# Altium schematic sheet Input.schdoc
size 420 x 297 mm; Author: G.K.; CompanyName: WUT; DrawnBy: G.K.; Address1: Warsaw Univeristy of Technology; Address2: Nowowiejska 15/19; DocumentNumber: 1; SheetNumber: 4; EDA_Number: ARTIQ; Projet: KASLI 3U subsystem; ModifiedBy: -; Title2: Input; DivGrp: ISE; Designer: G.K.; ModifiedDate: -; ProjectName: KASLI 3U subsystem
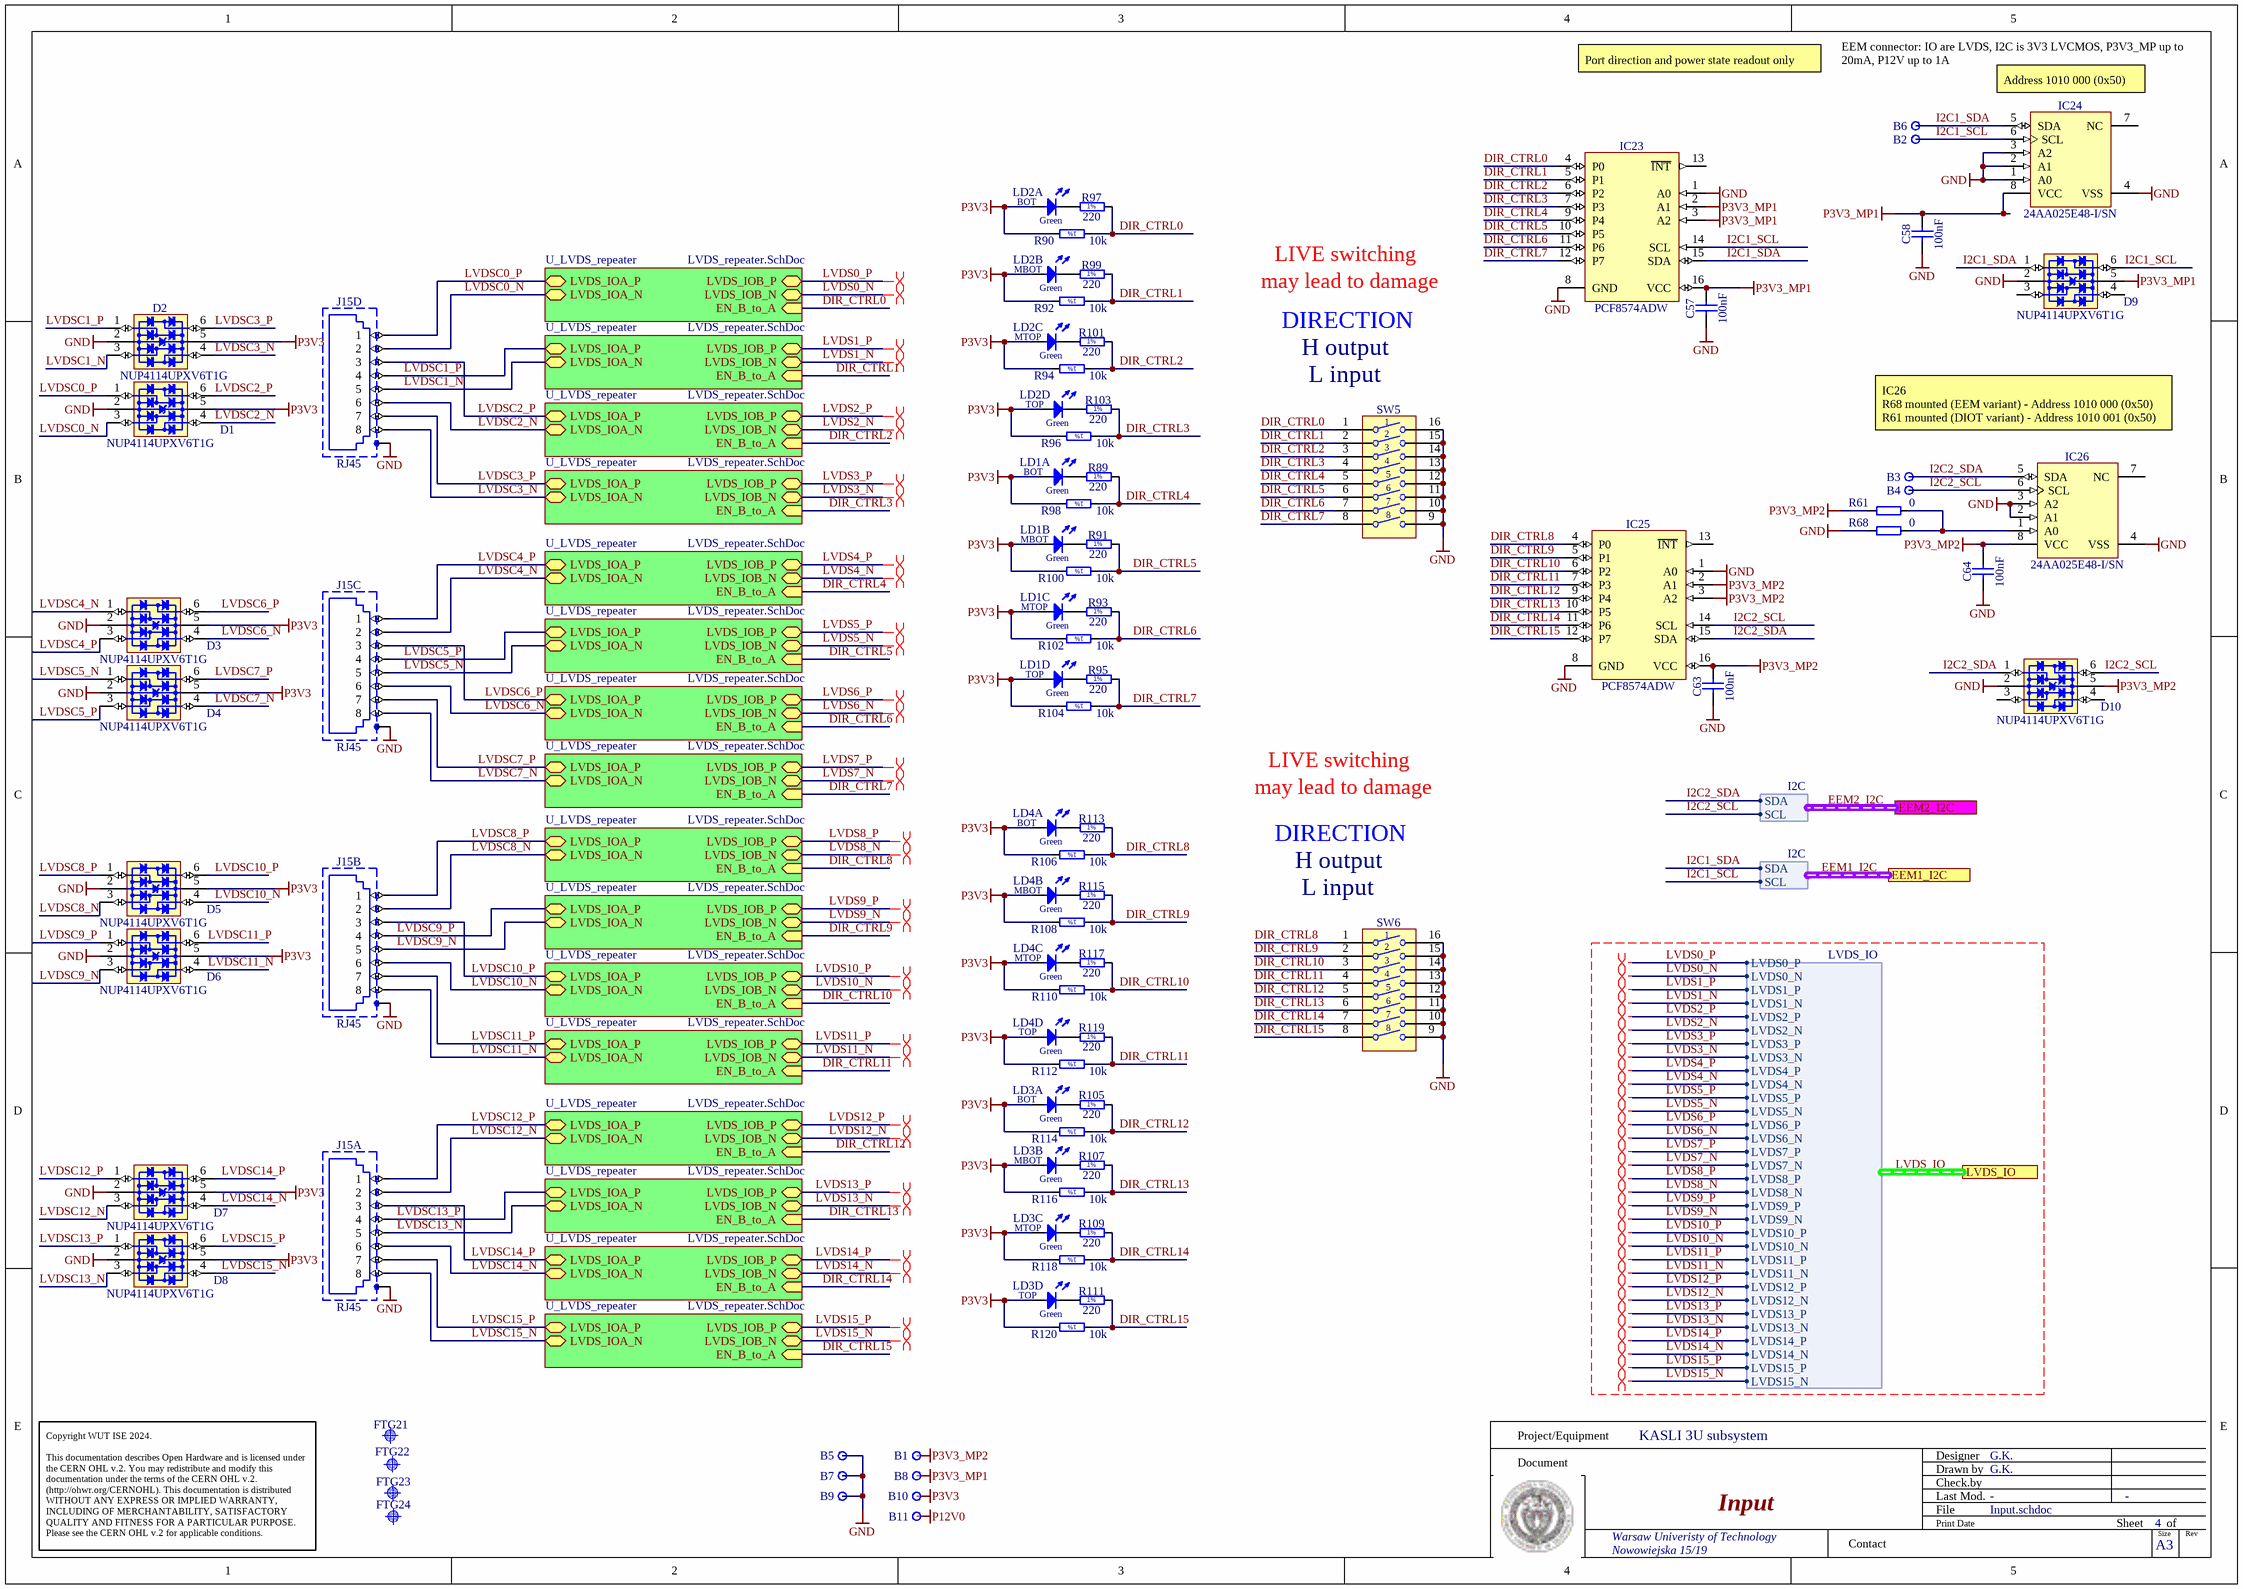
[diagram p0: Input.schdoc]

## Parts
B1  Plated Hole  [c130h60]  (value not drawn)
B2  Plated Hole  [c130h60]  (value not drawn)
B3  Plated Hole  [c130h60]  (value not drawn)
B4  Plated Hole  [c130h60]  (value not drawn)
B5  Plated Hole  [c130h60]  (value not drawn)
B6  Plated Hole  [c130h60]  (value not drawn)
B7  Plated Hole  [c130h60]  (value not drawn)
B8  Plated Hole  [c130h60]  (value not drawn)
B9  Plated Hole  [c130h60]  (value not drawn)
B10  Plated Hole  [c130h60]  (value not drawn)
B11  Plated Hole  [c130h60]  (value not drawn)
C57  100nF  [CAPC1005X55N]
C58  100nF  [CAPC1005X55N]
C63  100nF  [CAPC1005X55N]
C64  100nF  [CAPC1005X55N]
D1  NUP4114UPXV6T1G  [SOTFL50P160X60-6N]
D2  NUP4114UPXV6T1G  [SOTFL50P160X60-6N]
D3  NUP4114UPXV6T1G  [SOTFL50P160X60-6N]
D4  NUP4114UPXV6T1G  [SOTFL50P160X60-6N]
D5  NUP4114UPXV6T1G  [SOTFL50P160X60-6N]
D6  NUP4114UPXV6T1G  [SOTFL50P160X60-6N]
D7  NUP4114UPXV6T1G  [SOTFL50P160X60-6N]
D8  NUP4114UPXV6T1G  [SOTFL50P160X60-6N]
D9  NUP4114UPXV6T1G  [SOTFL50P160X60-6N]
D10  NUP4114UPXV6T1G  [SOTFL50P160X60-6N]
FTG21  Use only in PCB  [FIDUCIAL_TOP_C100-200]  (value not drawn)
FTG22  Use only in PCB  [FIDUCIAL_TOP_S100-200]  (value not drawn)
FTG23  Use only in PCB  [FIDUCIAL_TOP_S200-400]  (value not drawn)
FTG24  Use only in PCB  [FIDUCIAL_TOP_S100-200]  (value not drawn)
IC23  PCF8574ADW  [SOIC127P1030X265-16N]
IC24  24AA025E48-I/SN  [SOIC127P600X175-8N]
IC25  PCF8574ADW  [SOIC127P1030X265-16N]
IC26  24AA025E48-I/SN  [SOIC127P600X175-8N]
J15  RJ45  [TYCO_5406203-3]  (parts A,B,C,D of 4)
LD1  Green  [LED_BIVAR_H485CGDL]  (value not drawn)  (parts A,B,C,D of 4)
LD2  Green  [LED_BIVAR_H485CGDL]  (value not drawn)  (parts A,B,C,D of 4)
LD3  Green  [LED_BIVAR_H485CGDL]  (value not drawn)  (parts A,B,C,D of 4)
LD4  Green  [LED_BIVAR_H485CGDL]  (value not drawn)  (parts A,B,C,D of 4)
R61  0  [RESC1005X35N]
R68  0  [RESC1005X35N]
R89  220  [RESC1608X55N]
R90  10k  [RESC1005X40N]
R91  220  [RESC1608X55N]
R92  10k  [RESC1005X40N]
R93  220  [RESC1608X55N]
R94  10k  [RESC1005X40N]
R95  220  [RESC1608X55N]
R96  10k  [RESC1005X40N]
R97  220  [RESC1608X55N]
R98  10k  [RESC1005X40N]
R99  220  [RESC1608X55N]
R100  10k  [RESC1005X40N]
R101  220  [RESC1608X55N]
R102  10k  [RESC1005X40N]
R103  220  [RESC1608X55N]
R104  10k  [RESC1005X40N]
R105  220  [RESC1608X55N]
R106  10k  [RESC1005X40N]
R107  220  [RESC1608X55N]
R108  10k  [RESC1005X40N]
R109  220  [RESC1608X55N]
R110  10k  [RESC1005X40N]
R111  220  [RESC1608X55N]
R112  10k  [RESC1005X40N]
R113  220  [RESC1608X55N]
R114  10k  [RESC1005X40N]
R115  220  [RESC1608X55N]
R116  10k  [RESC1005X40N]
R117  220  [RESC1608X55N]
R118  10k  [RESC1005X40N]
R119  220  [RESC1608X55N]
R120  10k  [RESC1005X40N]
SW5  Switch  [SW_TYCO_1-1571983-0]  (value not drawn)
SW6  Switch  [SW_TYCO_1-1571983-0]  (value not drawn)

## Sub-sheets
U_LVDS_repeater = LVDS_repeater.SchDoc: LVDS_IOA_P (bidir), LVDS_IOA_N (bidir), LVDS_IOB_P (bidir), LVDS_IOB_N (bidir), EN_B_to_A (in)
U_LVDS_repeater = LVDS_repeater.SchDoc: LVDS_IOA_P (bidir), LVDS_IOA_N (bidir), LVDS_IOB_P (bidir), LVDS_IOB_N (bidir), EN_B_to_A (in)
U_LVDS_repeater = LVDS_repeater.SchDoc: LVDS_IOA_P (bidir), LVDS_IOA_N (bidir), LVDS_IOB_P (bidir), LVDS_IOB_N (bidir), EN_B_to_A (in)
U_LVDS_repeater = LVDS_repeater.SchDoc: LVDS_IOA_P (bidir), LVDS_IOA_N (bidir), LVDS_IOB_P (bidir), LVDS_IOB_N (bidir), EN_B_to_A (in)
U_LVDS_repeater = LVDS_repeater.SchDoc: LVDS_IOA_P (bidir), LVDS_IOA_N (bidir), LVDS_IOB_P (bidir), LVDS_IOB_N (bidir), EN_B_to_A (in)
U_LVDS_repeater = LVDS_repeater.SchDoc: LVDS_IOA_P (bidir), LVDS_IOA_N (bidir), LVDS_IOB_P (bidir), LVDS_IOB_N (bidir), EN_B_to_A (in)
U_LVDS_repeater = LVDS_repeater.SchDoc: LVDS_IOA_P (bidir), LVDS_IOA_N (bidir), LVDS_IOB_P (bidir), LVDS_IOB_N (bidir), EN_B_to_A (in)
U_LVDS_repeater = LVDS_repeater.SchDoc: LVDS_IOA_P (bidir), LVDS_IOA_N (bidir), LVDS_IOB_P (bidir), LVDS_IOB_N (bidir), EN_B_to_A (in)
U_LVDS_repeater = LVDS_repeater.SchDoc: LVDS_IOA_P (bidir), LVDS_IOA_N (bidir), LVDS_IOB_P (bidir), LVDS_IOB_N (bidir), EN_B_to_A (in)
U_LVDS_repeater = LVDS_repeater.SchDoc: LVDS_IOA_P (bidir), LVDS_IOA_N (bidir), LVDS_IOB_P (bidir), LVDS_IOB_N (bidir), EN_B_to_A (in)
U_LVDS_repeater = LVDS_repeater.SchDoc: LVDS_IOA_P (bidir), LVDS_IOA_N (bidir), LVDS_IOB_P (bidir), LVDS_IOB_N (bidir), EN_B_to_A (in)
U_LVDS_repeater = LVDS_repeater.SchDoc: LVDS_IOA_P (bidir), LVDS_IOA_N (bidir), LVDS_IOB_P (bidir), LVDS_IOB_N (bidir), EN_B_to_A (in)
U_LVDS_repeater = LVDS_repeater.SchDoc: LVDS_IOA_P (bidir), LVDS_IOA_N (bidir), LVDS_IOB_P (bidir), LVDS_IOB_N (bidir), EN_B_to_A (in)
U_LVDS_repeater = LVDS_repeater.SchDoc: LVDS_IOA_P (bidir), LVDS_IOA_N (bidir), LVDS_IOB_P (bidir), LVDS_IOB_N (bidir), EN_B_to_A (in)
U_LVDS_repeater = LVDS_repeater.SchDoc: LVDS_IOA_P (bidir), LVDS_IOA_N (bidir), LVDS_IOB_P (bidir), LVDS_IOB_N (bidir), EN_B_to_A (in)
U_LVDS_repeater = LVDS_repeater.SchDoc: LVDS_IOA_P (bidir), LVDS_IOA_N (bidir), LVDS_IOB_P (bidir), LVDS_IOB_N (bidir), EN_B_to_A (in)

## Ports
EEM1_I2C (harness I2C), EEM2_I2C (harness I2C), LVDS_IO (harness LVDS_IO)

## Harnesses
I2C: SDA, SCL
LVDS_IO: LVDS0_P, LVDS0_N, LVDS1_P, LVDS1_N, LVDS2_P, LVDS2_N, LVDS3_P, LVDS3_N, LVDS4_P, LVDS4_N, LVDS5_P, LVDS5_N, LVDS6_P, LVDS6_N, LVDS7_P, LVDS7_N, LVDS8_P, LVDS8_N, LVDS9_P, LVDS9_N, LVDS10_P, LVDS10_N, LVDS11_P, LVDS11_N, LVDS12_P, LVDS12_N, LVDS13_P, LVDS13_N, LVDS14_P, LVDS14_N, LVDS15_P, LVDS15_N

## Nets
GND: B5.1 B7.1 B9.1 C57.1 C58.1 C63.1 C64.1 D1.2(GND) D2.2(GND) D3.2(GND) D4.2(GND) D5.2(GND) D6.2(GND) D7.2(GND) D8.2(GND) D9.2(GND) D10.2(GND) IC23.1(A0) IC23.8(GND) IC24.1(A0) IC24.2(A1) IC24.3(A2) IC24.4(VSS) IC25.1(A0) IC25.8(GND) IC26.2(A1) IC26.3(A2) IC26.4(VSS) J15.SH R68.2 SW5.9 SW5.10 SW5.11 SW5.12 SW5.13 SW5.14 SW5.15 SW5.16 SW6.9 SW6.10 SW6.11 SW6.12 SW6.13 SW6.14 SW6.15 SW6.16
P3V3: B10.1 D1.5(VBUS) D2.5(VBUS) D3.5(VBUS) D4.5(VBUS) D5.5(VBUS) D6.5(VBUS) D7.5(VBUS) D8.5(VBUS) LD1.2(A) LD1.4(A) LD1.6(A) LD1.8(A) LD2.2(A) LD2.4(A) LD2.6(A) LD2.8(A) LD3.2(A) LD3.4(A) LD3.6(A) LD3.8(A) LD4.2(A) LD4.4(A) LD4.6(A) LD4.8(A) R90.2 R92.2 R94.2 R96.2 R98.2 R100.2 R102.2 R104.2 R106.2 R108.2 R110.2 R112.2 R114.2 R116.2 R118.2 R120.2
P3V3_MP1: B8.1 C57.2 C58.2 D9.5(VBUS) IC23.2(A1) IC23.3(A2) IC23.16(VCC) IC24.8(VCC)
P3V3_MP2: B1.1 C63.2 C64.2 D10.5(VBUS) IC25.2(A1) IC25.3(A2) IC25.16(VCC) IC26.8(VCC) R61.2
P12V0: B11.1
DIR_CTRL0: IC23.4(P0) R90.1 R97.2 SW5.1 ; sheet U_LVDS_repeater/EN_B_to_A
DIR_CTRL1: IC23.5(P1) R92.1 R99.2 SW5.2 ; sheet U_LVDS_repeater/EN_B_to_A
DIR_CTRL2: IC23.6(P2) R94.1 R101.2 SW5.3 ; sheet U_LVDS_repeater/EN_B_to_A
DIR_CTRL3: IC23.7(P3) R96.1 R103.2 SW5.4 ; sheet U_LVDS_repeater/EN_B_to_A
DIR_CTRL4: IC23.9(P4) R89.2 R98.1 SW5.5 ; sheet U_LVDS_repeater/EN_B_to_A
DIR_CTRL5: IC23.10(P5) R91.2 R100.1 SW5.6 ; sheet U_LVDS_repeater/EN_B_to_A
DIR_CTRL6: IC23.11(P6) R93.2 R102.1 SW5.7 ; sheet U_LVDS_repeater/EN_B_to_A
DIR_CTRL7: IC23.12(P7) R95.2 R104.1 SW5.8 ; sheet U_LVDS_repeater/EN_B_to_A
DIR_CTRL8: IC25.4(P0) R106.1 R113.2 SW6.1 ; sheet U_LVDS_repeater/EN_B_to_A
DIR_CTRL9: IC25.5(P1) R108.1 R115.2 SW6.2 ; sheet U_LVDS_repeater/EN_B_to_A
DIR_CTRL10: IC25.6(P2) R110.1 R117.2 SW6.3 ; sheet U_LVDS_repeater/EN_B_to_A
DIR_CTRL11: IC25.7(P3) R112.1 R119.2 SW6.4 ; sheet U_LVDS_repeater/EN_B_to_A
DIR_CTRL12: IC25.9(P4) R105.2 R114.1 SW6.5 ; sheet U_LVDS_repeater/EN_B_to_A
DIR_CTRL13: IC25.10(P5) R107.2 R116.1 SW6.6 ; sheet U_LVDS_repeater/EN_B_to_A
DIR_CTRL14: IC25.11(P6) R109.2 R118.1 SW6.7 ; sheet U_LVDS_repeater/EN_B_to_A
DIR_CTRL15: IC25.12(P7) R111.2 R120.1 SW6.8 ; sheet U_LVDS_repeater/EN_B_to_A
I2C1_SCL: B2.1 D9.6(I/O4) IC23.14(SCL) IC24.6(SCL) ; port EEM1_I2C.SCL  [project net EEM1_I2C.SCL]
I2C1_SDA: B6.1 D9.1(I/O1) IC23.15(SDA) IC24.5(SDA) ; port EEM1_I2C.SDA  [project net EEM1_I2C.SDA]
I2C2_SCL: B4.1 D10.6(I/O4) IC25.14(SCL) IC26.6(SCL) ; port EEM2_I2C.SCL  [project net EEM2_I2C.SCL]
I2C2_SDA: B3.1 D10.1(I/O1) IC25.15(SDA) IC26.5(SDA) ; port EEM2_I2C.SDA  [project net EEM2_I2C.SDA]
LVDS0_N: sheet U_LVDS_repeater/LVDS_IOB_N, port LVDS_IO.LVDS0_N
LVDS0_P: sheet U_LVDS_repeater/LVDS_IOB_P, port LVDS_IO.LVDS0_P
LVDS1_N: sheet U_LVDS_repeater/LVDS_IOB_N, port LVDS_IO.LVDS1_N
LVDS1_P: sheet U_LVDS_repeater/LVDS_IOB_P, port LVDS_IO.LVDS1_P
LVDS2_N: sheet U_LVDS_repeater/LVDS_IOB_N, port LVDS_IO.LVDS2_N
LVDS2_P: sheet U_LVDS_repeater/LVDS_IOB_P, port LVDS_IO.LVDS2_P
LVDS3_N: sheet U_LVDS_repeater/LVDS_IOB_N, port LVDS_IO.LVDS3_N
LVDS3_P: sheet U_LVDS_repeater/LVDS_IOB_P, port LVDS_IO.LVDS3_P
LVDS4_N: sheet U_LVDS_repeater/LVDS_IOB_N, port LVDS_IO.LVDS4_N
LVDS4_P: sheet U_LVDS_repeater/LVDS_IOB_P, port LVDS_IO.LVDS4_P
LVDS5_N: sheet U_LVDS_repeater/LVDS_IOB_N, port LVDS_IO.LVDS5_N
LVDS5_P: sheet U_LVDS_repeater/LVDS_IOB_P, port LVDS_IO.LVDS5_P
LVDS6_N: sheet U_LVDS_repeater/LVDS_IOB_N, port LVDS_IO.LVDS6_N
LVDS6_P: sheet U_LVDS_repeater/LVDS_IOB_P, port LVDS_IO.LVDS6_P
LVDS7_N: sheet U_LVDS_repeater/LVDS_IOB_N, port LVDS_IO.LVDS7_N
LVDS7_P: sheet U_LVDS_repeater/LVDS_IOB_P, port LVDS_IO.LVDS7_P
LVDS8_N: sheet U_LVDS_repeater/LVDS_IOB_N, port LVDS_IO.LVDS8_N
LVDS8_P: sheet U_LVDS_repeater/LVDS_IOB_P, port LVDS_IO.LVDS8_P
LVDS9_N: sheet U_LVDS_repeater/LVDS_IOB_N, port LVDS_IO.LVDS9_N
LVDS9_P: sheet U_LVDS_repeater/LVDS_IOB_P, port LVDS_IO.LVDS9_P
LVDS10_N: sheet U_LVDS_repeater/LVDS_IOB_N, port LVDS_IO.LVDS10_N
LVDS10_P: sheet U_LVDS_repeater/LVDS_IOB_P, port LVDS_IO.LVDS10_P
LVDS11_N: sheet U_LVDS_repeater/LVDS_IOB_N, port LVDS_IO.LVDS11_N
LVDS11_P: sheet U_LVDS_repeater/LVDS_IOB_P, port LVDS_IO.LVDS11_P
LVDS12_N: sheet U_LVDS_repeater/LVDS_IOB_N, port LVDS_IO.LVDS12_N
LVDS12_P: sheet U_LVDS_repeater/LVDS_IOB_P, port LVDS_IO.LVDS12_P
LVDS13_N: sheet U_LVDS_repeater/LVDS_IOB_N, port LVDS_IO.LVDS13_N
LVDS13_P: sheet U_LVDS_repeater/LVDS_IOB_P, port LVDS_IO.LVDS13_P
LVDS14_N: sheet U_LVDS_repeater/LVDS_IOB_N, port LVDS_IO.LVDS14_N
LVDS14_P: sheet U_LVDS_repeater/LVDS_IOB_P, port LVDS_IO.LVDS14_P
LVDS15_N: sheet U_LVDS_repeater/LVDS_IOB_N, port LVDS_IO.LVDS15_N
LVDS15_P: sheet U_LVDS_repeater/LVDS_IOB_P, port LVDS_IO.LVDS15_P
LVDSC0_N: D1.3(I/O2) J15.2D(2) ; sheet U_LVDS_repeater/LVDS_IOA_N
LVDSC0_P: D1.1(I/O1) J15.1D(1) ; sheet U_LVDS_repeater/LVDS_IOA_P
LVDSC1_N: D2.3(I/O2) J15.5D(5) ; sheet U_LVDS_repeater/LVDS_IOA_N
LVDSC1_P: D2.1(I/O1) J15.4D(4) ; sheet U_LVDS_repeater/LVDS_IOA_P
LVDSC2_N: D1.4(I/O3) J15.6D(6) ; sheet U_LVDS_repeater/LVDS_IOA_N
LVDSC2_P: D1.6(I/O4) J15.3D(3) ; sheet U_LVDS_repeater/LVDS_IOA_P
LVDSC3_N: D2.4(I/O3) J15.8D(8) ; sheet U_LVDS_repeater/LVDS_IOA_N
LVDSC3_P: D2.6(I/O4) J15.7D(7) ; sheet U_LVDS_repeater/LVDS_IOA_P
LVDSC4_N: D3.1(I/O1) J15.2C(2) ; sheet U_LVDS_repeater/LVDS_IOA_N
LVDSC4_P: D3.3(I/O2) J15.1C(1) ; sheet U_LVDS_repeater/LVDS_IOA_P
LVDSC5_N: D4.1(I/O1) J15.5C(5) ; sheet U_LVDS_repeater/LVDS_IOA_N
LVDSC5_P: D4.3(I/O2) J15.4C(4) ; sheet U_LVDS_repeater/LVDS_IOA_P
LVDSC6_N: D3.4(I/O3) J15.6C(6) ; sheet U_LVDS_repeater/LVDS_IOA_N
LVDSC6_P: D3.6(I/O4) J15.3C(3) ; sheet U_LVDS_repeater/LVDS_IOA_P
LVDSC7_N: D4.4(I/O3) J15.8C(8) ; sheet U_LVDS_repeater/LVDS_IOA_N
LVDSC7_P: D4.6(I/O4) J15.7C(7) ; sheet U_LVDS_repeater/LVDS_IOA_P
LVDSC8_N: D5.3(I/O2) J15.2B(2) ; sheet U_LVDS_repeater/LVDS_IOA_N
LVDSC8_P: D5.1(I/O1) J15.1B(1) ; sheet U_LVDS_repeater/LVDS_IOA_P
LVDSC9_N: D6.3(I/O2) J15.5B(5) ; sheet U_LVDS_repeater/LVDS_IOA_N
LVDSC9_P: D6.1(I/O1) J15.4B(4) ; sheet U_LVDS_repeater/LVDS_IOA_P
LVDSC10_N: D5.4(I/O3) J15.6B(6) ; sheet U_LVDS_repeater/LVDS_IOA_N
LVDSC10_P: D5.6(I/O4) J15.3B(3) ; sheet U_LVDS_repeater/LVDS_IOA_P
LVDSC11_N: D6.4(I/O3) J15.8B(8) ; sheet U_LVDS_repeater/LVDS_IOA_N
LVDSC11_P: D6.6(I/O4) J15.7B(7) ; sheet U_LVDS_repeater/LVDS_IOA_P
LVDSC12_N: D7.3(I/O2) J15.2A(2) ; sheet U_LVDS_repeater/LVDS_IOA_N
LVDSC12_P: D7.1(I/O1) J15.1A(1) ; sheet U_LVDS_repeater/LVDS_IOA_P
LVDSC13_N: D8.3(I/O2) J15.5A(5) ; sheet U_LVDS_repeater/LVDS_IOA_N
LVDSC13_P: D8.1(I/O1) J15.4A(4) ; sheet U_LVDS_repeater/LVDS_IOA_P
LVDSC14_N: D7.4(I/O3) J15.6A(6) ; sheet U_LVDS_repeater/LVDS_IOA_N
LVDSC14_P: D7.6(I/O4) J15.3A(3) ; sheet U_LVDS_repeater/LVDS_IOA_P
LVDSC15_N: D8.4(I/O3) J15.8A(8) ; sheet U_LVDS_repeater/LVDS_IOA_N
LVDSC15_P: D8.6(I/O4) J15.7A(7) ; sheet U_LVDS_repeater/LVDS_IOA_P
NetIC26_1: IC26.1(A0) R61.1 R68.1
NetLD1_1: LD1.1(C) R89.1
NetLD1_3: LD1.3(C) R91.1
NetLD1_5: LD1.5(C) R93.1
NetLD1_7: LD1.7(C) R95.1
NetLD2_1: LD2.1(C) R97.1
NetLD2_3: LD2.3(C) R99.1
NetLD2_5: LD2.5(C) R101.1
NetLD2_7: LD2.7(C) R103.1
NetLD3_1: LD3.1(C) R105.1
NetLD3_3: LD3.3(C) R107.1
NetLD3_5: LD3.5(C) R109.1
NetLD3_7: LD3.7(C) R111.1
NetLD4_1: LD4.1(C) R113.1
NetLD4_3: LD4.3(C) R115.1
NetLD4_5: LD4.5(C) R117.1
NetLD4_7: LD4.7(C) R119.1

Not connected (* = marked no-connect by the designer): D9 3(I/O2) 4(I/O3); D10 3(I/O2) 4(I/O3); IC23 13(~{INT}); IC24 7(NC); IC25 13(~{INT}); IC26 7(NC)

## Buses and harness runs
harness EEM1_I2C = port EEM1_I2C
harness EEM2_I2C = port EEM2_I2C
harness LVDS_IO = port LVDS_IO

## Layout directives
differential pair: LVDS0_N, LVDS0_P, LVDS1_N, LVDS1_P, LVDS2_N, LVDS2_P, LVDS3_N, LVDS3_P, LVDS4_N, LVDS4_P, LVDS5_N, LVDS5_P, LVDS6_N, LVDS6_P, LVDS7_N, LVDS7_P, LVDS8_N, LVDS8_P, LVDS9_N, LVDS9_P, LVDS10_N, LVDS10_P, LVDS11_N, LVDS11_P, LVDS12_N, LVDS12_P, LVDS13_N, LVDS13_P, LVDS14_N, LVDS14_P, LVDS15_N, LVDS15_P

## Notes on the sheet
- Port direction and power state readout only
- EEM connector: IO are LVDS, I2C is 3V3 LVCMOS, P3V3_MP up to 20mA, P12V up to 1A
- (near IC24) Address 1010 000 (0x50)
- LIVE switching
- may lead to damage
- DIRECTION
- H output
- (near SW5) L input
- IC26
  R68 mounted (EEM variant) - Address 1010 000 (0x50)
  R61 mounted (DIOT variant) - Address 1010 001 (0x50)
- (near SW6) L input
- Project/Equipment
- Document
- Designer
- Drawn by
- Check.by
- Copyright WUT ISE 2024.
  This documentation describes Open Hardware and is licensed under the CERN OHL v.2. You may redistribute and modify this documentation under the terms of the CERN OHL v.2. (http://ohwr.org/CERNOHL). This documentation is distributed WITHOUT ANY EXPRESS OR IMPLIED WARRANTY, INCLUDING OF MERCHANTABILITY, SATISFACTORY QUALITY AND FITNESS FOR A PARTICULAR PURPOSE. Please see the CERN OHL v.2 for applicable conditions.
- Contact
- File
- Last Mod.
- Print Date
- Sheet
- Size
- A3
- of
- Rev
- (in symbol LED_BIVAR_H485CGDL, part A) BOT
- (in symbol LED_BIVAR_H485CGDL, part B) MBOT
- (in symbol LED_BIVAR_H485CGDL, part C) MTOP
- (in symbol LED_BIVAR_H485CGDL, part D) TOP
- (in symbol R0402_10K_1%_0.0625W_100PPM) 1%
- (in symbol R0603_220R_1%_0.1W_100PPM) 1%

## Library data of the parts
B1-B11 = PLATED_HOLE0.6_PAD1.3: Single Terminal Socket; Part Description: Plated Through Hole: Hole Dia.=0.6mm Pad Dia.=1.3mm; Mounted: No; Part Number: PLATED_HOLE0.6_PAD1.3; Component Kind: Standard (No BOM); Component Type: Standard (No BOM); Pin Count: 1; Family: Plated Hole; Socket: No; SMD: No; Sense: No; Status: None; ComponentHeight: 0mm; HelpURL: Undefined; Author: CERN DEM MR; CreateDate: 02.03.2016; LatestRevisionDate: 02.03.2016; PackageDescription: Plated Through Hole: Hole Dia.=0.6mm Pad Dia.=1.3mm
C57 C58 C63 C64 = CC0402_100NF_16V_10%_X5R: Non-polarised capacitor; Part Description: SMD Multilayer Chip Ceramic Capacitor; Manufacturer: GENERIC; Manufacturer1 Part Number: GRM155R61C104KA88D; Voltage: 16V; TC: X5R; Tolerance: ±10%; Part Number: CC0402_100NF_16V_10%_X5R; Component Kind: Standard; Component Type: Standard; Pin Count: 2; Value: 100nF; Status: None; Manufacturer Part Number: CC0402_100NF_16V_10%_X5R; Case: 0402; Mounted: Yes; Socket: No; SMD: Yes; Sense: No; Manufacturer1 Example: MURATA; Manufacturer1 ComponentHeight: 0.55mm; HelpURL: \\cern.ch\dfs\Applications\Altium\Datasheets\CC0402_X5R_MURATA_GRM.pdf; Author: CERN DEM JLC; CreateDate: 10.12.2013; LatestRevisionDate: 10.12.2013
D1-D10 = NUP4114UPXV6T1G: Part Description: ESD Protection Diodes Array (8kV) with Low Clamping Voltage; Manufacturer: ON SEMICONDUCTOR; Voltage: 5.5V; PressFit: No; Bonding: No; Part Number: NUP4114UPXV6T1G; Component Kind: Standard; Component Type: Standard; Device: NUP4114UPXV6T1G; PackageDescription: SOTFL (SOT666, SOT563,), 0.50mm, Pitch; 6 Pin, 1.20mm W X 1.60mm L X 0.60mm H Body, IPC Medium Density; Manufacturer Part Number: NUP4114UPXV6T1G; Pin Count: 8; Mounted: Yes; Socket: No; SMD: Yes; Sense: No; ComponentHeight: 1.75mm; HelpURL: \\cern.ch\dfs\Applications\Altium\Datasheets\NUP4114UPXV6T1G.pdf; Author: CERN DEM JLC; CreateDate: 05.12.2012; LatestRevisionDate: 05.12.2012
FTG21 = FIDUCIAL_TARGET_C100-200: Fiducial Target; Part Description: Round Fiducial Target, Top Layer, 1.0mm, Top Solder 2.0mm, Keepout =2.0mm; Mounted: No; Part Number: FIDUCIAL_TARGET_C100-200; Component Kind: Standard (No BOM); Component Type: Standard (No BOM); Pin Count: 1; Family: Fiducial; Socket: No; SMD: Yes; Sense: No; Status: None; ComponentHeight: 0mm; HelpURL: Undefined; Author: CERN DEM JLC; CreateDate: 09.02.2010; LatestRevisionDate: 04.04.2012; PackageDescription: Round Fiducial Target, Top Layer, 1.0mm, Top Solder 2.0mm, Keepout =2.0mm
FTG22 FTG24 = FIDUCIAL_TARGET_S100-200: Fiducial Target; Part Description: Square Fiducial Target, Top Layer, 1.0mm, Top Solder 2.0mm, Keepout =2.0mm; Mounted: No; Part Number: FIDUCIAL_TARGET_S100-200; Component Kind: Standard (No BOM); Component Type: Standard (No BOM); Pin Count: 1; Family: Fiducial; Socket: No; SMD: Yes; Sense: No; Status: None; ComponentHeight: 0mm; HelpURL: Undefined; Author: CERN DEM JLC; CreateDate: 09.02.2010; LatestRevisionDate: 04.04.2012; PackageDescription: Square Fiducial Target, Top Layer, 1.0mm, Top Solder 2.0mm, Keepout =2.0mm
FTG23 = FIDUCIAL_TARGET_S200-400: Fiducial Target; Part Description: Square Fiducial Target, Top Layer, 2.0mm, Top Solder 4.0mm, Keepout =4.0mm; Mounted: No; Part Number: FIDUCIAL_TARGET_S200-400; Component Kind: Standard (No BOM); Component Type: Standard (No BOM); Pin Count: 1; Family: Fiducial; Socket: No; SMD: Yes; Sense: No; Status: None; ComponentHeight: 0mm; HelpURL: Undefined; Author: CERN DEM JLC; CreateDate: 02.06.2008; LatestRevisionDate: 04.04.2012; PackageDescription: Square Fiducial Target, Top Layer, 2.0mm, Top Solder 4.0mm, Keepout =4.0mm
IC23 IC25 = PCF8574ADW: Remote 8-bit I/O Expander For I2C Bus; Manufacturer: TEXAS INSTRUMENTS; PressFit: No; Bonding: No; Part Number: PCF8574ADW; Component Kind: Standard; Component Type: Standard; Device: PCF8574ADW; PackageDescription: SOIC 16, Pitch 1.27mm - Body 7.5x10.3mm, IPC Medium Density; Part Description: Remote 8-bit I/O Expander For I2C Bus; Manufacturer Part Number: PCF8574ADW; Pin Count: 16; Case: SOIC16W; Mounted: Yes; Socket: No; SMD: Yes; Sense: No; ComponentHeight: 2.65mm; Author: CERN DEM JLC; HelpURL: \\cern.ch\dfs\Applications\Altium\Datasheets\PCF8574ADW.pdf; CreateDate: 01.11.2012; LatestRevisionDate: 01.11.2012
IC24 IC26 = 24AA025E48-I/SN: 1.7V-5.5V, 2K I2C™ Serial EEPROMs with EUI-48™ Node Identity; Manufacturer: MICROCHIP TECHNOLOGY; PressFit: No; Bonding: No; Part Number: 24AA025E48-I/SN; Component Kind: Standard; Component Type: Standard; Device: 24AA025E48-I/SN; PackageDescription: SOIC, 1.27mm Pitch; 8 Pin - Body 4x5mm, IPC Medium Density; Part Description: 1.7V-5.5V, 2K I2C™ Serial EEPROMs with EUI-48™ Node Identity; Manufacturer Part Number: 24AA025E48-I/SN; Pin Count: 8; Case: SOIC8; Mounted: Yes; Socket: No; SMD: Yes; Sense: No; ComponentHeight: 1.75mm; HelpURL: \\cern.ch\dfs\Applications\Altium\Datasheets\24AA025E48-I-SN.pdf; Author: CERN DEM MR; CreateDate: 19.07.2016; LatestRevisionDate: 19.07.2016
J15 = TYCO_5406203-3: Connector 4 x RJ45 + Shield; Part Description: Modular RJ45 Jack, 4 Port, 8 Positions, Shielded, Reverse Panel Ground Tabs, Category 5; Manufacturer: TYCO ELECTRONICS; PressFit: No; Part Number: TYCO_5406203-3; Component Kind: Standard; Component Type: Standard; Pin Count: 33; Family: RJ45; Mounted: Yes; Socket: No; SMD: No; Sense: No; Status: None; Manufacturer Part Number: 5406203-3; ComponentHeight: 13.64mm; HelpURL: \\cern.ch\dfs\Applications\Altium\Datasheets\TYCO_5406203-3.pdf; Author: CERN DEM JLC; CreateDate: 30.10.2008; LatestRevisionDate: 30.10.2008
LD1-LD4 = LED_BIVAR_H485CGDL: LED x4 Green 1C2A-BOT_3C4A_5C6A_7C8A-TOP; Part Description: Quad-Level 2mm Green LED, PCB Edge Mounting; Manufacturer: BIVAR; PressFit: No; Bonding: No; Part Number: LED_BIVAR_H485CGDL; Component Kind: Standard; Component Type: Standard; Color: Green; PackageDescription: Quad-Level 2mm Green, PCB Edge Mounting  BIVAR H485CHDL; Manufacturer Part Number: H485CGDL; Pin Count: 8; Mounted: Yes; Socket: No; SMD: No; Sense: No; ComponentHeight: 11.3mm; HelpURL: \\cern.ch\dfs\Applications\Altium\Datasheets\LED_BIVAR_H485CGDL.pdf; Author: CERN DEM JLC; CreateDate: 04.06.2012; LatestRevisionDate: 04.06.2012
R61 R68 = R0402_0R_JUMPER: Resistor; Part Description: 1A (0.05R Max DC Resistance) Zero Ohm Jumper; Manufacturer: GENERIC; Manufacturer1 Part Number: 232270591001L; Part Number: R0402_0R_JUMPER; Component Kind: Standard; Component Type: Standard; Footprint: RESC1005X40N; Pin Count: 2; Value: 0; Status: Not recommended; Manufacturer Part Number: R0402_0R_JUMPER; Case: 0402; Mounted: Yes; Sense: No; Socket: No; SMD: Yes; Manufacturer1 Example: YAGEO PHYCOMP; Manufacturer1 ComponentHeight: 0.4mm; HelpURL: \\cern.ch\dfs\Applications\Altium\Datasheets\R0402_Phycomp_RC0402.pdf; Author: CERN DEM JLC; CreateDate: 03.12.2007; LatestRevisionDate: 17.10.2012
R89 R91 R93 R95 R97 R99 R101 R103 R105 R107 R109 R111 R113 R115 R117 R119 = R0603_220R_1%_0.1W_100PPM: Resistor - 1%; Part Description: General Purpose Thick Film Chip Resistor; Manufacturer: GENERIC; Manufacturer1 Part Number: NRC06F2200TRF; Power: 0.1W; TC: ±100ppm/°C; Part Number: R0603_220R_1%_0.1W_100PPM; Component Kind: Standard; Component Type: Standard; Pin Count: 2; Value: 220; Status: Preferred; Tolerance: ±1%; Manufacturer Part Number: R0603_220R_1%_0.1W_100PPM; Case: 0603; Mounted: Yes; Sense: No; Socket: No; SMD: Yes; Manufacturer1 Example: NIC COMPONENT; Manufacturer1 ComponentHeight: 0.55mm; HelpURL: \\cern.ch\dfs\Applications\Altium\Datasheets\R0603_NIC_NRC.pdf; Author: CERN DEM JLC; CreateDate: 03.12.2007; LatestRevisionDate: 13.03.2008
R90 R92 R94 R96 R98 R100 R102 R104 R106 R108 R110 R112 R114 R116 R118 R120 = R0402_10K_1%_0.0625W_100PPM: Resistor - 1%; Part Description: General Purpose Thick Film Chip Resistor; Manufacturer: GENERIC; Manufacturer1 Part Number: 232270671003L; TC: ±100ppm/°C; Part Number: R0402_10K_1%_0.0625W_100PPM; Component Kind: Standard; Component Type: Standard; Pin Count: 2; Value: 10k; Status: Not recommended; Power: 0.0625W; Tolerance: ±1%; Manufacturer Part Number: R0402_10K_1%_0.0625W_100PPM; Case: 0402; Mounted: Yes; Sense: No; Socket: No; SMD: Yes; Manufacturer1 Example: YAGEO PHYCOMP; Manufacturer1 ComponentHeight: 0.4mm; HelpURL: \\cern.ch\dfs\Applications\Altium\Datasheets\R0402_Phycomp_RC0402.pdf; Author: CERN DEM JLC; CreateDate: 03.12.2007; LatestRevisionDate: 17.10.2012
SW5 SW6 = SW_TYCO_1-1571983-0: 8 Ways SPST DIP Switch; Part Description: 8 Way SPST SMD DIP Switch, Latched, Contact Rating 0.025A 24VDC; Manufacturer: TYCO; Manufacturer Part Number: 1-1571983-0 or GDH08S04; PressFit: No; Part Number: SW_TYCO_1-1571983-0; Component Kind: Standard; Component Type: Standard; Pin Count: 16; PackageDescription: Pitch 1.27mm,  Body 11.28x6.2mm, 8 Ways SPST Surface-Mount DIP Switch,TYCO GDH Serie; Family: Switch; Mounted: Yes; Socket: No; SMD: Yes; Sense: No; Status: None; ComponentHeight: 2.31mm; HelpURL: \\cern.ch\dfs\Applications\Altium\Datasheets\SW_TYCO_1-1571983-0.pdf; Author: CERN DEM JLC; CreateDate: 08.01.2009; LatestRevisionDate: 08.01.2009